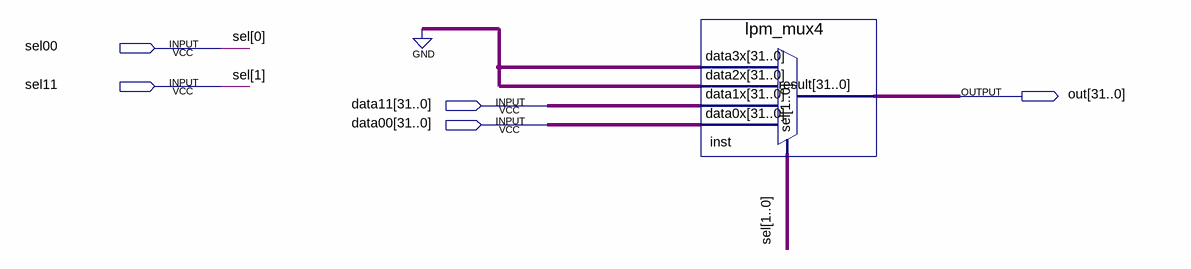
[diagram p0: schematic sheet]
// Quartus schematic MUX_3.bdf as structural Verilog: 1 symbols, 5 pins
module MUX_3 (
  input  sel00,
  input  sel11,
  input  [31:0] data11,
  input  [31:0] data00,
  output [31:0] out
);

  lpm_mux4 inst (
    .data3x({32{1'b0}}), .data2x({32{1'b0}}), .data1x(data11), .data0x(data00), .sel({sel11, sel00}),
    .result(out));

  // Other names for the same wires on the sheet: sel[1:0] = {sel11, sel00}
endmodule
